# EAGLE design beacon (EAGLE 9.5.2)

## Sheet 1 of 4: Power
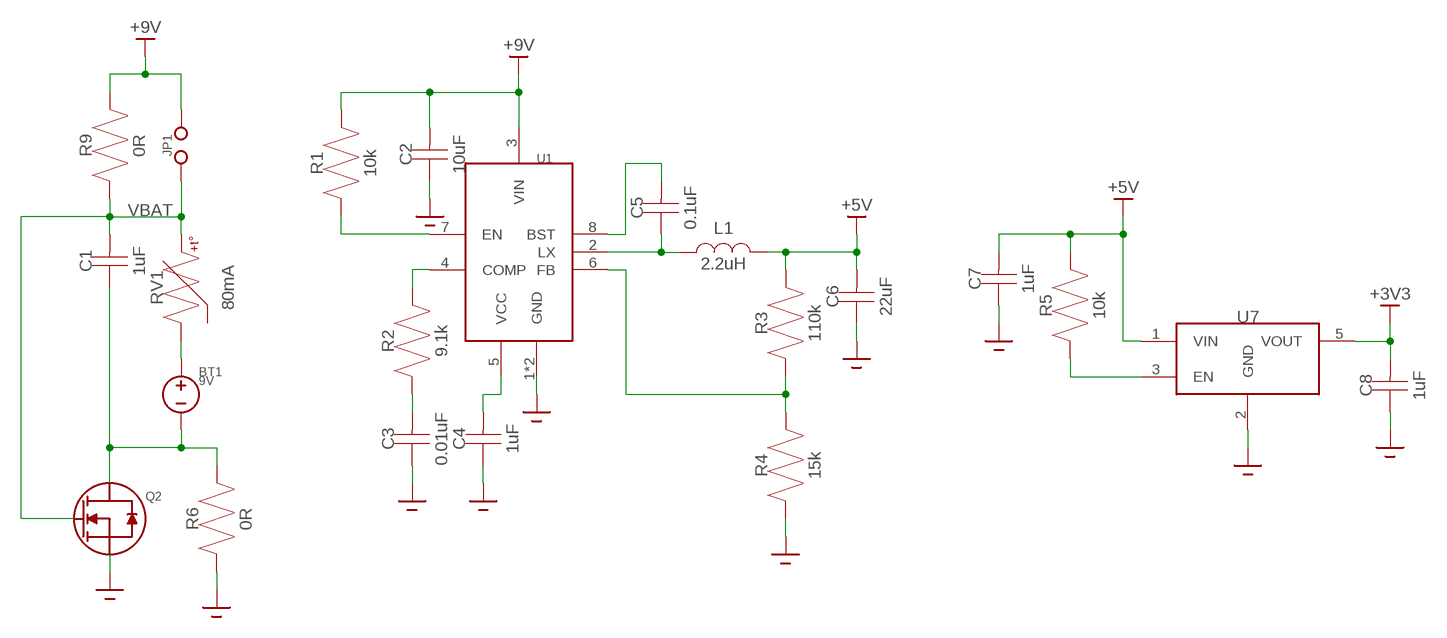
[diagram p0: schematic, sheet 1]

### Parts
BT1  9V  BATTERY  [JUMPER]
C1  1uF  CAPACITOR0603  [0603]
C2  10uF  CAPACITOR0805  [0805]
C3  0.01uF  CAPACITOR0603  [0603]
C4  1uF  CAPACITOR0603  [0603]
C5  0.1uF  CAPACITOR0603  [0603]
C6  22uF  CAPACITOR0805  [0805]
C7  1uF  CAPACITOR0603  [0603]
C8  1uF  CAPACITOR0603  [0603]
JP1  JUMPER  [JUMPER]
L1  2.2uH  INDUCTOR0805  [0805]
Q2  DMG2302UK  [DMG2302UK]
R1  10k  RESISTOR0603  [0603]
R2  9.1k  RESISTOR0603  [0603]
R3  110k  RESISTOR0603  [0603]
R4  15k  RESISTOR0603  [0603]
R5  10k  RESISTOR0603  [0603]
R6  0R  RESISTOR0805  [0805]
R9  0R  RESISTOR0805  [0805]
RV1  80mA  PTC0603  [0603]
U1  AOZ6662DI  [AOZ6662DI]
U7  MIC5504  [MIC5504]

### Nets
+3V3: C8.P$2 U7.5(VOUT) ; also sheet 2,3,4
+5V: C6.P$2 C7.P$2 L1.P$2 R3.P$2 R5.P$2 U7.1(VIN) ; also sheet 2,3,4
+9V: C2.P$2 JP1.2 R1.P$2 R9.P$2 U1.3(VIN) ; also sheet 2
GND: C2.P$1 C3.P$1 C4.P$1 C6.P$1 C7.P$1 C8.P$1 Q2.2(S) R4.P$1 R6.P$1 U1.1(GND) U1.9(GND) U7.2(GND) ; also sheet 2,3,4
N$1: R2.P$2 U1.4(COMP)
N$2: R1.P$1 U1.7(EN)
N$3: C3.P$2 R2.P$1
N$4: C4.P$2 U1.5(VCC)
N$5: C5.P$2 U1.8(BST)
N$6: C5.P$1 L1.P$1 U1.2(LX)
N$7: R3.P$1 R4.P$2 U1.6(FB)
N$8: BT1.1 C1.P$1 Q2.3(D) R6.P$2
N$9: R5.P$1 U7.3(EN)
N$12: BT1.2 RV1.P$1
VBAT: C1.P$2 JP1.1 Q2.1(G) R9.P$1 RV1.P$2 ; also sheet 2

## Sheet 2 of 4: MCU
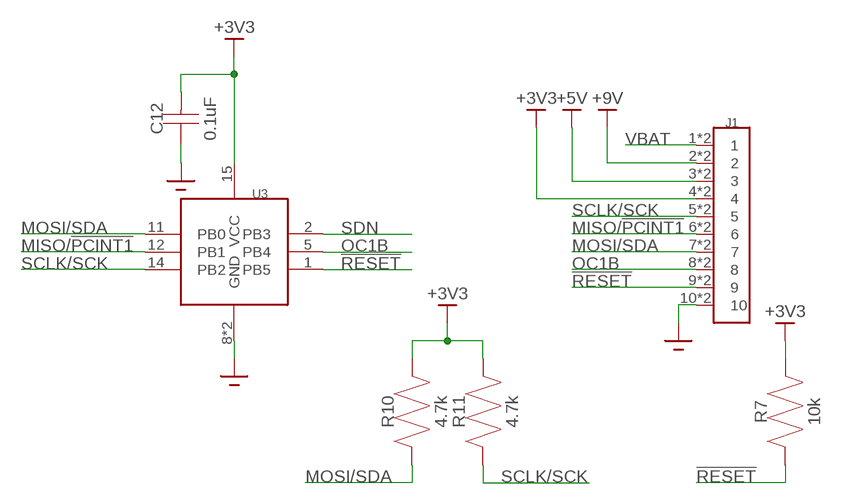
[diagram p1: schematic, sheet 2]

### Parts
C12  0.1uF  CAPACITOR0603  [0603]
J1  5-5530843-0MALE  [5-5530843-0-M]
R7  10k  RESISTOR0603  [0603]
R10  4.7k  RESISTOR0603  [0603]
R11  4.7k  RESISTOR0603  [0603]
U3  ATTINY85  [ATTINY85]

### Nets
!RESET: J1.9 J1.19 R7.P$1 U3.1(PB5)
+3V3: C12.P$2 J1.4 J1.14 R7.P$2 R10.P$2 R11.P$2 U3.15(VCC) ; also sheet 1,3,4
+5V: J1.3 J1.13 ; also sheet 1,3,4
+9V: J1.2 J1.12 ; also sheet 1
GND: C12.P$1 J1.10 J1.20 U3.8(GND) U3.21(GND) ; also sheet 1,3,4
MISO/!PCINT1: J1.6 J1.16 U3.12(PB1) ; also sheet 4
MOSI/SDA: J1.7 J1.17 R10.P$1 U3.11(PB0) ; also sheet 3,4
OC1B: J1.8 J1.18 U3.5(PB4) ; also sheet 3
SCLK/SCK: J1.5 J1.15 R11.P$1 U3.14(PB2) ; also sheet 3,4
SDN: U3.2(PB3) ; also sheet 4
VBAT: J1.1 J1.11 ; also sheet 1

## Sheet 3 of 4: Extras
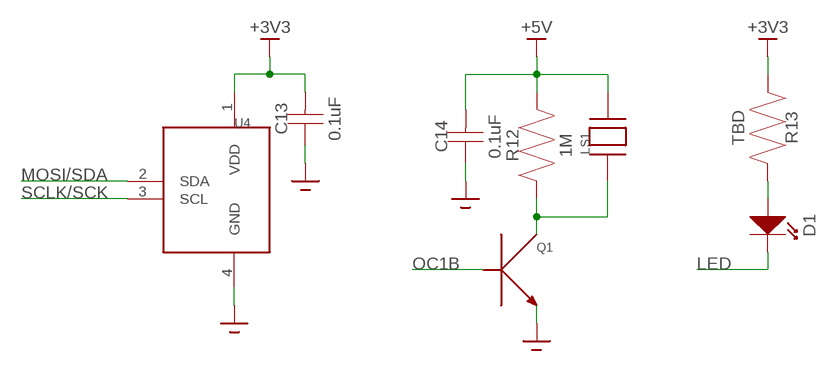
[diagram p2: schematic, sheet 3]

### Parts
C13  0.1uF  CAPACITOR0603  [0603]
C14  0.1uF  CAPACITOR0603  [0603]
D1  LED  [0805]
LS1  AT-1224-TWT-5V-2-R  [AT-1224-TWT-5V-2-R]
Q1  MMBT3904  [MMBT3904]
R12  1M  RESISTOR0603  [0603]
R13  TBD  RESISTOR0603  [0603]
U4  MS5637-02BA03  [MS5637-02BA03]

### Nets
+3V3: C13.P$2 R13.P$1 U4.1(VDD) ; also sheet 1,2,4
+5V: C14.P$2 LS1.2 R12.P$2 ; also sheet 1,2,4
GND: C13.P$1 C14.P$1 Q1.2(E) U4.4(GND) ; also sheet 1,2,4
LED: D1.P$2(OUT) ; also sheet 4
MOSI/SDA: U4.2(SDA) ; also sheet 2,4
N$15: LS1.1 Q1.3(C) R12.P$1
N$16: D1.P$1(IN) R13.P$2
OC1B: Q1.1(B) ; also sheet 2
SCLK/SCK: U4.3(SCL) ; also sheet 2,4

## Sheet 4 of 4: RF
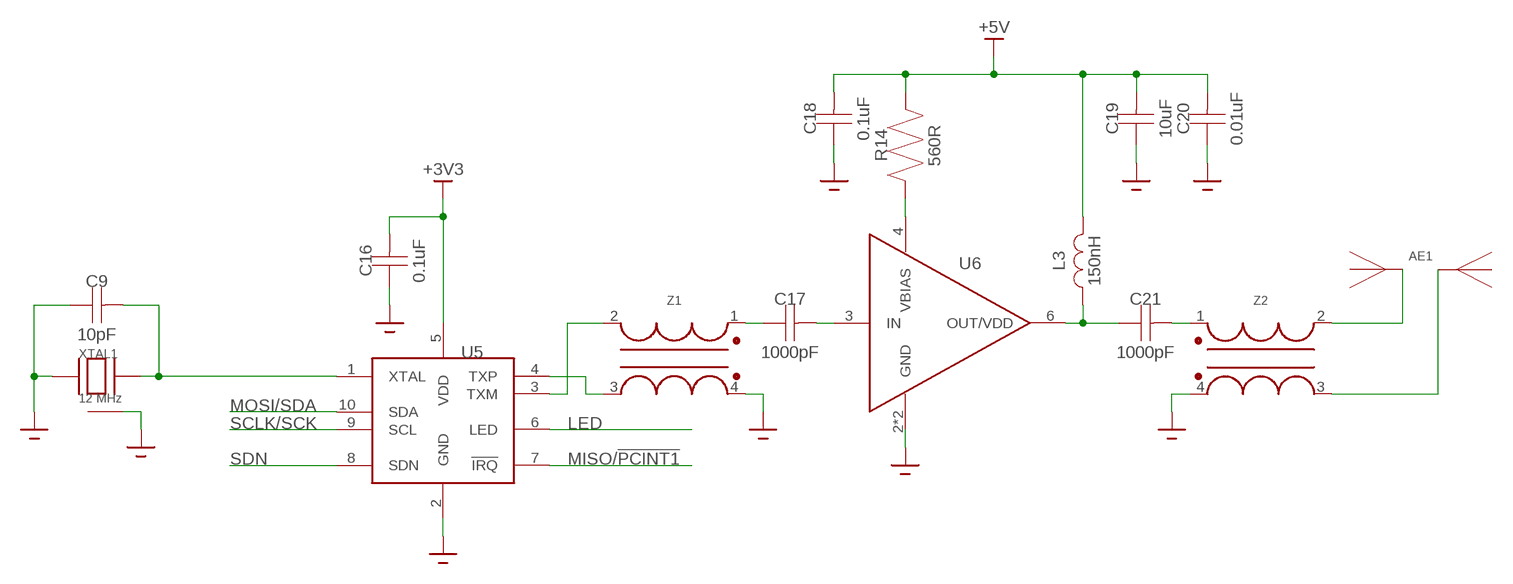
[diagram p3: schematic, sheet 4]

### Parts
AE1  ANTENNA  [ANTENNA]
C9  10pF  CAPACITOR0603  [0603]
C16  0.1uF  CAPACITOR0603  [0603]
C17  1000pF  CAPACITOR0402  [0402]
C18  0.1uF  CAPACITOR0603  [0603]
C19  10uF  CAPACITOR0603  [0603]
C20  0.01uF  CAPACITOR0603  [0603]
C21  1000pF  CAPACITOR0402  [0402]
L3  150nH  INDUCTOR0402  [0402]
R14  560R  RESISTOR0603  [0603]
U5  SI4012  [SI4012]
U6  MAAL-010704  [MAAL-010704]
XTAL1  12 MHz  RH100  [RH100]
Z1  ABT-8  [ABT-8]
Z2  ABT-8  [ABT-8]

### Nets
+3V3: C16.P$2 U5.5(VDD) ; also sheet 1,2,3
+5V: C18.P$2 C19.P$2 C20.P$2 L3.2 R14.P$2 ; also sheet 1,2,3
GND: C9.P$1 C16.P$1 C18.P$1 C19.P$1 C20.P$1 U5.2(GND) U6.2(GND) U6.5(GND) XTAL1.1(GND) XTAL1.2 XTAL1.3(GND) Z1.4(UN2) Z2.4(UN2) ; also sheet 1,2,3
LED: U5.6(LED) ; also sheet 3
MISO/!PCINT1: U5.7(!IRQ) ; also sheet 2
MOSI/SDA: U5.10(SDA) ; also sheet 2,3
N$10: U5.4(TXP) Z1.3(BAL2)
N$11: U5.3(TXM) Z1.2(BAL1)
N$17: C9.P$2 U5.1(XTAL) XTAL1.4
N$20: C21.1 L3.1 U6.6(OUT/VDD)
N$21: C17.1 Z1.1(UN1)
N$22: C17.2 U6.3(IN)
N$26: R14.P$1 U6.4(VBIAS)
N$29: C21.2 Z2.1(UN1)
N$30: AE1.LB AE1.LT Z2.2(BAL1)
N$31: AE1.RB AE1.RT Z2.3(BAL2)
SCLK/SCK: U5.9(SCL) ; also sheet 2,3
SDN: U5.8(SDN) ; also sheet 2

## Library data of the parts
AE1 = radio-tracker:ANTENNA
BT1 = radio-tracker:BATTERY
C1-C9 C12-C14 C16-C21 = radio-tracker:CAPACITOR
D1 = radio-tracker:LED
J1 = radio-tracker:5-5530843-0
JP1 = radio-tracker:JUMPER
L1 L3 = radio-tracker:INDUCTOR
LS1 = radio-tracker:AT-1224-TWT-5V-2-R
Q1 = radio-tracker:MMBT3904
Q2 = radio-tracker:DMG2302UK
R1-R7 R9-R14 = radio-tracker:RESISTOR
RV1 = radio-tracker:PTC
U1 = radio-tracker:AOZ6662DI
U3 = radio-tracker:ATTINY85
U4 = radio-tracker:MS5637-02BA03
U5 = radio-tracker:SI4012
U6 = radio-tracker:MAAL-010704
U7 = radio-tracker:MIC5504
XTAL1 = radio-tracker:RH100
Z1 Z2 = radio-tracker:ABT-8

## Board
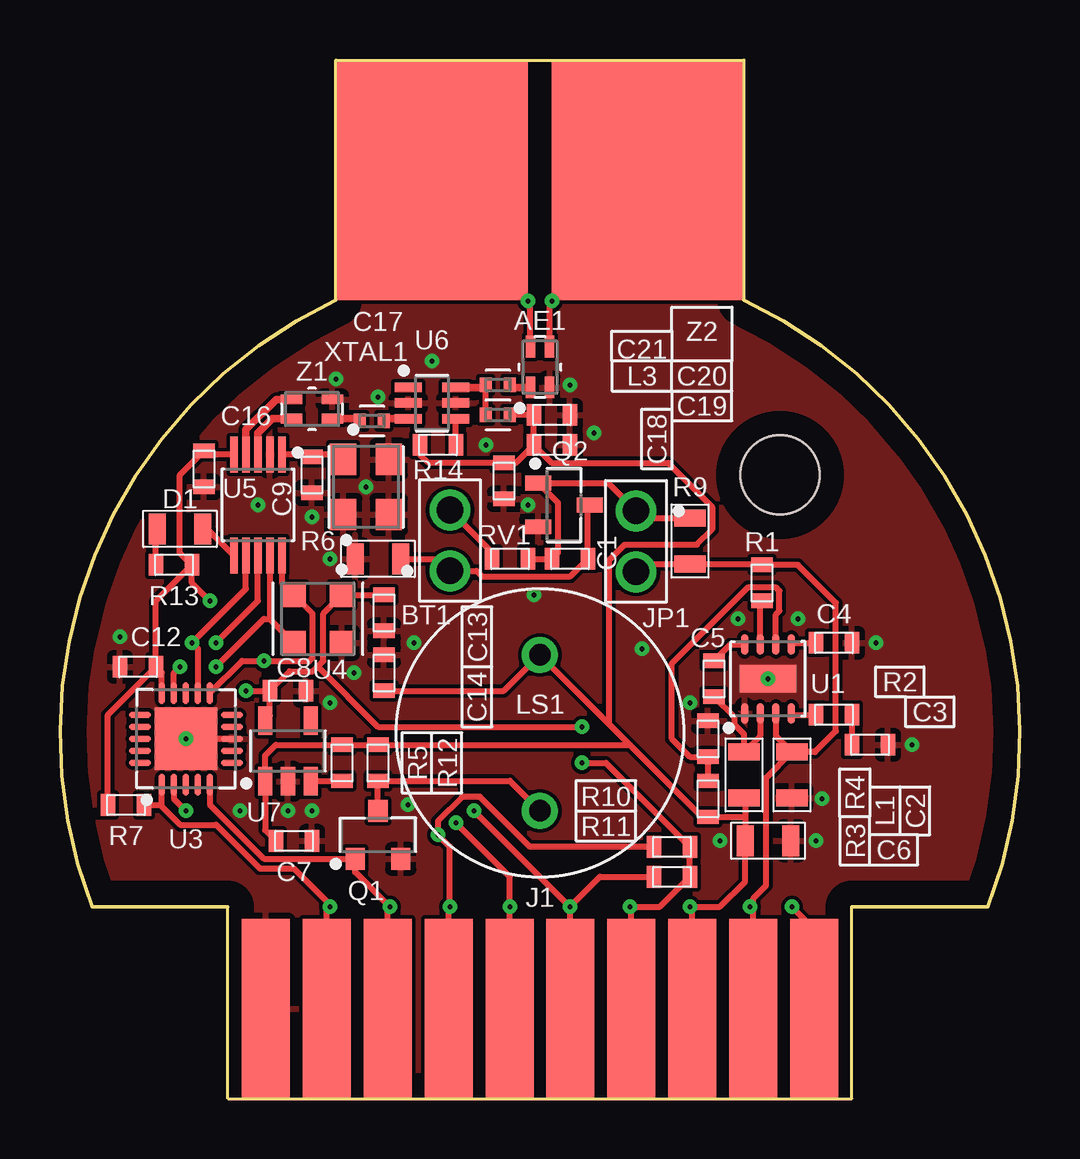
[diagram p4: board, top side]
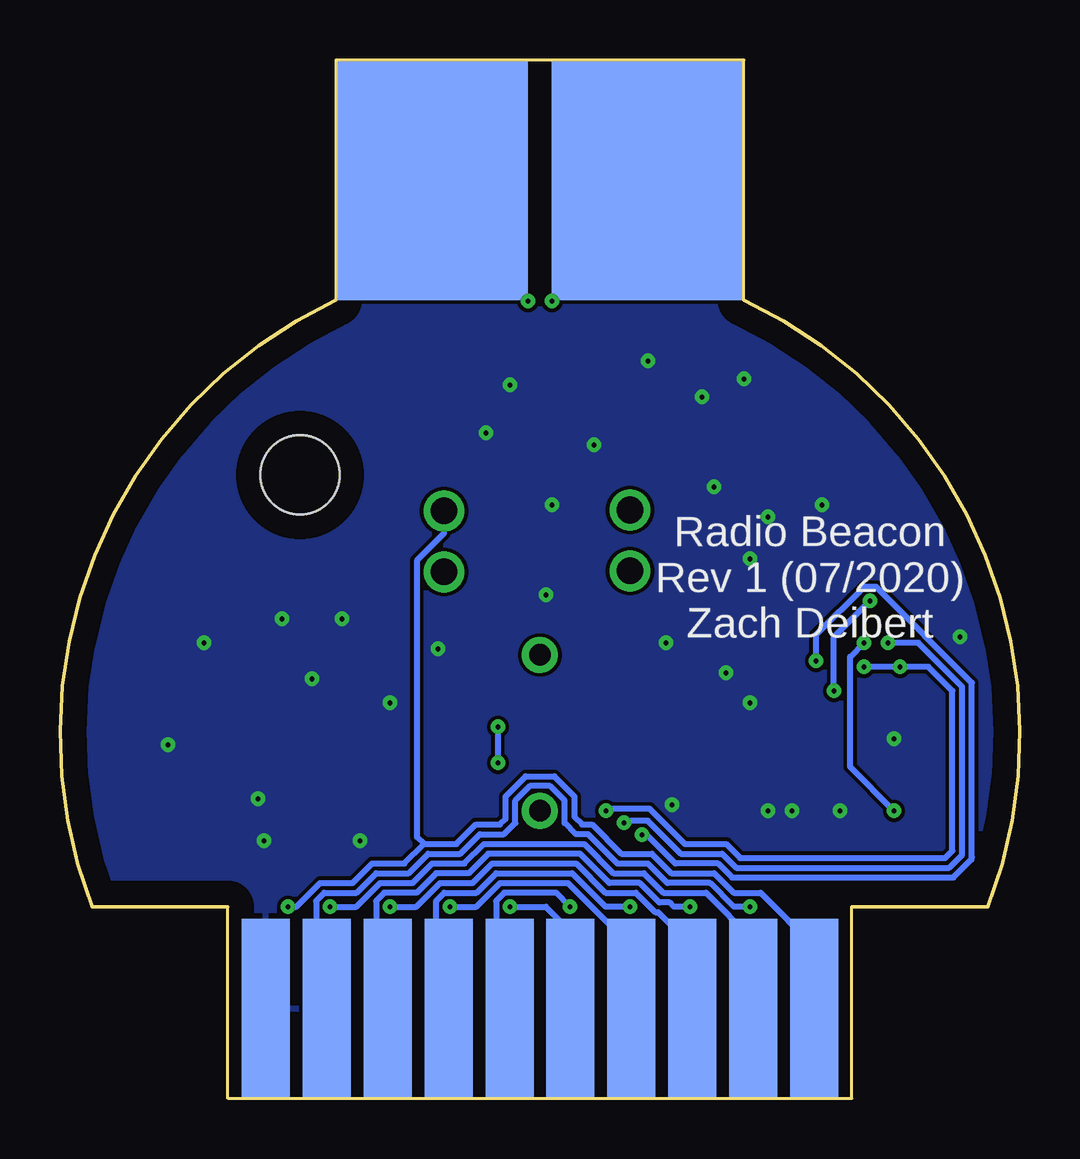
[diagram p5: board, bottom side, seen from below]

Size 40 x 43.3 mm. Coordinates in mm from the lower left corner, seen from the top.
Outline: 7,8 1.34,8 arc-86 11.5,33.3
Outline: 33,8 38.66,8 arc86 28.5,33.3
Copper layers (1*16): Top 0.035mm / dielectric 1.5mm / Bottom 0.035mm
Design rules "default *": minimum track width 6mil, minimum drill 0.2mm, track to track 6mil, track to pad 6mil, pad to pad 6mil, via to via 6mil, smd to smd 6mil, copper to edge 40mil, drill to drill 6mil, minimum pad ring 10mil, minimum via ring 8mil, stop-mask expansion 4mil, vias tented up to drill 0mil, thermal gap 10mil
Holes 3.3 mm at 30,26

### Footprints (pad centres in the part's own frame; a part is rotated, then mirrored left to right if it is on the bottom)
ANTENNA = smd 8 x 10 bottom: LB -4.5,5; RB 4.5,5 | smd 8 x 10: LT -4.5,5; RT 4.5,5
JUMPER = drill 1.105 pad 1.705: 1 0,0; 2 2.54,0
0603 = smd 0.6 x 0.9: P$1 -0.75,0; P$2 0.75,0
0805 = smd 0.711 x 1.295: P$1 -0.953,0; P$2 0.953,0
0402 = smd 0.5 x 0.6: 1 -0.5,0; 2 0.5,0
5-5530843-0-M = smd 2 x 7.49: 1 11.43,3.745; 2 8.89,3.745; 3 6.35,3.745; 4 3.81,3.745; 5 1.27,3.745; 6 -1.27,3.745; 7 -3.81,3.745; 8 -6.35,3.745; 9 -8.89,3.745; 10 -11.43,3.745 | smd 2 x 7.49 bottom: 11 -11.43,3.745; 12 -8.89,3.745; 13 -6.35,3.745; 14 -3.81,3.745; 15 -1.27,3.745; 16 1.27,3.745; 17 3.81,3.745; 18 6.35,3.745; 19 8.89,3.745; 20 11.43,3.745
AT-1224-TWT-5V-2-R = drill 0.9 pad 1.5: 1 -3.25,0; 2 3.25,0
MMBT3904 = smd 0.9 x 0.8: 1 -1,0.95; 2 -1,-0.95; 3 1,0
DMG2302UK = smd 1.088 x 0.609: 1 -1.07,0.915; 2 -1.07,-0.915; 3 1.07,0
AOZ6662DI = smd 0.86 x 0.317: 1 -1.435,0.975; 2 -1.435,0.325; 3 -1.435,-0.325; 4 -1.435,-0.975; 5 1.435,-0.975; 6 1.435,-0.325; 7 1.435,0.325; 8 1.435,0.975 | smd 1.15 x 2.35: 9 0,0
ATTINY85 = smd 0.91 x 0.27: 1 -1.91,1; 2 -1.91,0.5; 3 -1.91,0; 4 -1.91,-0.5; 5 -1.91,-1; 11 1.91,-1; 12 1.91,-0.5; 13 1.91,0; 14 1.91,0.5; 15 1.91,1 | smd 0.27 x 0.91: 6 -1,-1.91; 7 -0.5,-1.91; 8 0,-1.91; 9 0.5,-1.91; 10 1,-1.91; 16 1,1.91; 17 0.5,1.91; 18 0,1.91; 19 -0.5,1.91; 20 -1,1.91 | smd 2.6 x 2.6: 21 0,0
MS5637-02BA03 = smd 1 x 1: 1 -1,1; 2 -1,-1; 3 1,-1; 4 1,1
SI4012 = smd 1.503 x 0.325: 1 -2.104,1; 2 -2.104,0.5; 3 -2.104,0; 4 -2.104,-0.5; 5 -2.104,-1; 6 2.104,-1; 7 2.104,-0.5; 8 2.104,0; 9 2.104,0.5; 10 2.104,1
MAAL-010704 = smd 1.129 x 0.397: 1 -0.991,0.65; 2 -0.991,0; 3 -0.991,-0.65; 4 0.991,-0.65; 5 0.991,0; 6 0.991,0.65
MIC5504 = smd 1.186 x 0.584: 1 -1.264,0.95; 2 -1.264,0; 3 -1.264,-0.95; 4 1.264,-0.95; 5 1.264,0.95
RH100 = smd 1.3 x 1.1: 1 -1.15,0.95; 2 -1.15,-0.95; 3 1.15,-0.95; 4 1.15,0.95
ABT-8 = smd 0.9 x 0.4: 1 -0.85,0.4; 2 0.85,0.4; 3 0.85,-0.4; 4 -0.85,-0.4

### Placement (x,y rotation side)
AE1  20,43.3 180 bottom
BT1  16.25,22 90 top
C1  21.25,22.5 180 top
C2  30.5,13.5 90 top
C3  33.75,14.75 180 top
C4  32.25,19 180 top
C5  27.25,17.5 90 top
C6  29.5,10.75 180 top
C7  9.75,10.75 180 top
C8  9.5,17 180 top
C9  10.5,26 90 top
C12  3.25,18 0 top
C13  13.5,20.25 90 top
C14  13.5,17.75 270 top
C16  6,26.25 90 top
C17  13,28.25 0 top
C18  18.5,25.75 90 top
C19  20.5,27.25 180 top
C20  20.5,28.5 180 top
C21  18.25,29.75 0 top
D1  5,23.75 0 top
J1  20,0 0 top
JP1  24,24.5 270 top
L1  28.5,13.5 270 top
L3  18.25,28.5 0 top
LS1  20,15.25 90 top
Q1  13.25,11 90 top
Q2  21,24.75 0 top
R1  29.25,21.5 90 top
R2  32.25,16 180 top
R3  27,12.5 270 top
R4  27,15 270 top
R5  11.75,14 90 top
R6  13.25,22.5 0 top
R7  2.75,12.25 180 top
R9  26.25,23.25 270 top
R10  25.5,10.5 0 top
R11  25.5,9.25 0 top
R12  13.25,14 90 top
R13  4.75,22.25 180 top
R14  15.75,27.25 180 top
RV1  18.75,22.5 0 top
U1  29.5,17.5 90 top
U3  5.25,15 90 top
U4  10.75,20 270 top
U5  8.25,24.75 270 top
U6  15.5,29 0 top
U7  9.5,14.5 90 top
XTAL1  12.75,25.5 90 top
Z1  10.5,28.75 180 top
Z2  20,30.5 90 top

### Tracks (layer width: path | path; a pad name or v marks a point on that pad's centre or on a via)
!RESET  (via drill 0.2)
  Top 0.254: J1.9 11.11,7.86 v11.25,8 11.25,8.09 9.75,9.59 8.33,9.59 6.51,11.42 5.01,11.42 4.25,12.18 | 4.25,12.18 U3.1 | R7.P$1 4.18,12.25 4.25,12.18
  Bottom 0.254: J1.19 29.33,4.19 29.33,8.24 28.99,8.58 27.64,8.58 26.83,9.39 25.48,9.39 24.66,10.21 23.31,10.21 22.5,11.02 21.5,11.02 21.03,11.49 21.03,12.43 20.43,13.03 19.57,13.03 18.97,12.43 18.97,11.49 18.5,11.02 17.99,11.02 16.77,9.8 15.5,9.8 14.69,8.99 12.91,8.99 11.92,8 v11.25,8
+3V3  (via drill 0.2)
  Top 0.254: U5.5 6.15,26.86 C16.P$2 5,26 5,22.75 R13.P$1 | C13.P$2 U4.1 10.97,20.22 10.97,18.25 10.73,18.02 | U3.15 4.25,17.75 C12.P$2 | C12.P$2 4,20.75 R13.P$1 | v6.25,20.75 5.5,21.5 R13.P$1 | U7.5 8.75,15.96 C8.P$2 | C8.P$2 9.56,17.81 10.53,17.81 10.73,18.02 | v7.75,17 C8.P$2 | J1.4 23.81,7.94 v23.75,8 25,8 R11.P$2 R10.P$2 22.75,14 v21.75,14 | v21.75,15.5 13.25,15.5 10.73,18.02 | R7.P$2 2,16 C12.P$2
  Bottom 0.254: v7.75,17 7.75,19.25 v6.25,20.75 | J1.14 16.19,3.06 16.25,3 16.25,6.41 18.83,8.99 21.66,8.99 22.65,8 v23.75,8 | v21.75,15.5 v21.75,14
+5V  (via drill 0.2)
  Top 0.254: L1.P$2 28.55,12.5 28.55,11.75 | 28.55,11.75 C6.P$2 28.55,9.05 27.5,8 v26.25,8 26.35,7.9 J1.3 | 28.55,11.75 R3.P$2 26.75,11.75 23.75,14.75 | C7.P$2 8.55,11.2 U7.1 8.55,14.3 9,14.75 R5.P$2 R12.P$2 23.75,14.75 | R14.P$2 15,26.86 15.33,26.52 18.48,26.52 C18.P$2 19,26.5 C19.P$2 | C19.P$2 C20.P$2 L3.2 | 23.75,14.75 22.87,15.63 | 22.87,15.63 LS1.2 18.5,17 C14.P$2 | C19.P$2 20.5,26.5 25.35,26.5 27.18,24.67 27.18,23.73 26.54,23.09 23.53,23.09 22.87,22.43 22.87,15.63
  Bottom 0.254: v26.25,8 25.15,8 24.16,8.99 22.81,8.99 22,9.8 18.5,9.8 17.28,8.58 16.01,8.58 15.19,7.77 15.07,7.77 13.65,6.34 J1.13
+9V  (via drill 0.2)
  Top 0.254: U1.3 29.82,15.13 C2.P$2 | C2.P$2 31.45,14.45 32.33,15.33 32.33,20.67 30.75,22.25 R1.P$2 29.2,22.3 R9.P$2 24.34,22.3 JP1.2 | J1.2 28.89,7.86 | 28.89,7.86 28.89,8.36 29.43,8.9 29.43,13.38 C2.P$2 | 28.89,7.86 v28.75,8
  Bottom 0.254: v28.75,8 27.65,8 26.66,8.99 25.31,8.99 24.5,9.8 23.15,9.8 22.33,10.62 18.16,10.62 16.94,9.39 15.67,9.39 14.86,8.58 13.08,8.58 11.11,6.61 J1.12
GND  (via drill 0.2)
  Top 0.254: U3.8 U3.21
  other vias: 5.25,15 9.5,12 10.5,12 11.25,16.5 14.5,12.25 2.5,19.25 8.25,24.75 10.5,24.25 11.25,22.5 12.25,17.75 14.75,19 12.75,25.5 11.5,30 13.25,29.25 21.25,29.75 19.75,21 19.5,24.75 29.5,17.5 34,19 35.5,14.75 31.75,12.5 31.5,10.75 26.25,16.5 24.25,18.75 28.25,20 30.75,20 27.5,10.75 7.5,12 17.75,27.25 15.5,30.75 22.25,27.75
  pour Top: 0,0 0,43 19,43 40,43 40,11 40,0
  pour Bottom: 0,0 0,43 24,43 40,43 40,18 40,0
LED
  Top 0.254: D1.P$2 6.15,23.75 U5.6
MISO/!PCINT1  (via drill 0.2)
  Top 0.254: U3.12 5.75,18.75 v5.5,19 7.75,21.25 U5.7 | J1.6 18.73,7.98 v18.75,8 18.75,9.25 v16.5,11.5
  Bottom 0.254: v18.75,8 19.33,8.58 21.49,8.58 21.83,8.24 21.83,4.31 J1.16 | v5.5,19 4.24,19 2.41,17.17 2.41,10.17 2.95,9.63 11.83,9.63 12.41,10.21 14.13,10.21 15.51,11.58 16.42,11.58 v16.5,11.5
MOSI/SDA  (via drill 0.2)
  Top 0.254: U5.10 9.25,21.5 U4.2 10.53,20.22 10.53,18.38 10.37,18.22 8.53,18.22 v8.5,18.25 7.59,18.25 U3.11 | R10.P$1 19.57,10.5 17.49,12.58 16.76,12.58 15.75,11.57 v15.75,11 16.25,10.5 v16.25,8 16.19,7.94 J1.7
  Bottom 0.254: J1.17 24.33,4.27 24.33,8.24 23.99,8.58 22.64,8.58 21.83,9.39 18.67,9.39 17.27,8 v16.25,8 | v15.75,11 15.55,11 14.35,9.8 12.58,9.8 11.99,9.22 2.78,9.22 2.03,9.97 2,10.07 2,17.34 6,21.33 6.49,21.33 8.5,19.32 v8.5,18.25
N$1
  Top 0.254: U1.4 30.54,16 R2.P$2
N$2
  Top 0.254: U1.7 29.17,20.68 R1.P$1
N$3
  Top 0.254: R2.P$1 C3.P$2
N$4
  Top 0.254: U1.5 30.54,19 C4.P$2
N$5
  Top 0.254: C5.P$2 27.93,18.93 U1.8
N$6
  Top 0.254: U1.2 29.17,15.13 L1.P$1 28.5,15.2 28.09,15.61 28.09,15.91 C5.P$1
N$7
  Top 0.254: R3.P$1 R4.P$2 26.25,14.25 25.5,15 25.5,18.14 28.68,21.33 29.82,21.33 29.98,21.17 29.98,20.33 29.82,20.18 U1.6
N$8
  Top 0.254: R6.P$2 15.75,22.5 BT1.1 17.35,22 17.58,21.77 21.27,21.77 C1.P$1 22,24.68 Q2.3
N$9
  Top 0.254: R5.P$1 11.74,13.24 U7.3
N$10
  Top 0.305: U5.4 7.75,27.9 9,29.15 Z1.3
N$11
  Top 0.305: U5.3 8.25,27.75 8.85,28.35 Z1.2
N$12
  Top 0.254: BT1.2 18,22.79 RV1.P$1
N$15
  Top 0.254: LS1.1 18.75,13.25 R12.P$1 Q1.3
N$16
  Top 0.254: R13.P$2 4,23.7 D1.P$1
N$17
  Top 0.254: XTAL1.4 11.59,26.86 10.5,26.86 | 10.5,26.86 U5.1 | C9.P$2 10.5,26.86
N$20
  Top 0.254: L3.1 C21.1
  Top 0.305: U6.6 17.65,29.65 C21.1
N$21
  Top 0.305: Z1.1 12.4,28.35 C17.1
N$22
  Top 0.305: U6.3 13.6,28.35 C17.2
N$26
  Top 0.254: R14.P$1 U6.4
N$29
  Top 0.305: Z2.1 18.85,29.65 C21.2
N$30  (via drill 0.2)
  Top 0.254: Z2.2 19.6,33.15 v19.5,33.25 15.5,37.25 AE1.LT
  Bottom 0.254: v19.5,33.25 15.5,37.25 AE1.LT
N$31  (via drill 0.2)
  Top 0.254: Z2.3 20.4,33.15 v20.5,33.25 24.5,37.25 AE1.RT
  Bottom 0.254: v20.5,33.25 24.5,37.25 AE1.RT
OC1B  (via drill 0.2)
  Top 0.254: U3.5 6.25,12.25 8.5,10 Q1.1 12.3,9.45 v13.75,8 13.65,7.9 J1.8
  Bottom 0.254: J1.18 26.83,4.23 26.83,8.24 26.49,8.58 25.14,8.58 24.33,9.39 22.98,9.39 22.16,10.21 18.33,10.21 17.11,8.99 15.84,8.99 15.03,8.18 14.6,8.18 14.42,8 v13.75,8
SCLK/SCK  (via drill 0.2)
  Top 0.254: U5.9 8.75,20 | 8.75,20 U4.3 | U3.14 4.75,17.75 v5,18 | v6.5,18 8.5,20 8.75,20 | J1.5 21.27,7.98 v21.25,8 | v21.25,8 22.5,9.25 R11.P$1 | v17.25,12 v21.25,8
  Bottom 0.254: v6.5,18 v5,18 3.81,18 2.81,17 2.81,10.34 3.12,10.03 11.66,10.03 12.24,10.62 13.97,10.62 15.43,12.08 17.17,12.08 v17.25,12 | v21.25,8 19.75,8 18.73,6.98 J1.15
SDN  (via drill 0.2)
  Top 0.254: v6.5,19 8.25,20.75 U5.8 | U3.2 4.75,12.5 v5.25,12
  Bottom 0.254: v5.25,12 7.08,13.83 7.08,18.42 v6.5,19
VBAT  (via drill 0.2)
  Top 0.254: R9.P$1 24.3,24.2 JP1.1 22.83,25.66 Q2.1 20.75,24.84 20.75,22.75 C1.P$2 RV1.P$2 | J1.1 31.43,7.07 v30.5,8
  Bottom 0.254: v30.5,8 30.15,8 29.16,8.99 27.81,8.99 27,9.8 25.65,9.8 24.83,10.62 | J1.11 8.57,3.07 8.5,3 8.5,6.28 10.81,8.58 11.93,8.58 12.75,9.39 14.52,9.39 15.33,10.21 16.6,10.21 17.82,11.43 18.24,11.43 18.56,11.75 18.56,12.6 19.4,13.44 20.59,13.44 21.44,12.6 21.44,11.66 21.67,11.43 22.67,11.43 23.48,10.62 24.83,10.62 | JP1.1 24,23.56 25.13,22.43 25.13,10.91 24.83,10.62

### Text on the board
bNames: Radio Beacon / Rev 1 (07/2020) / Zach Deibert